# EAGLE design small_Eagle (1) (EAGLE 9.5.2)
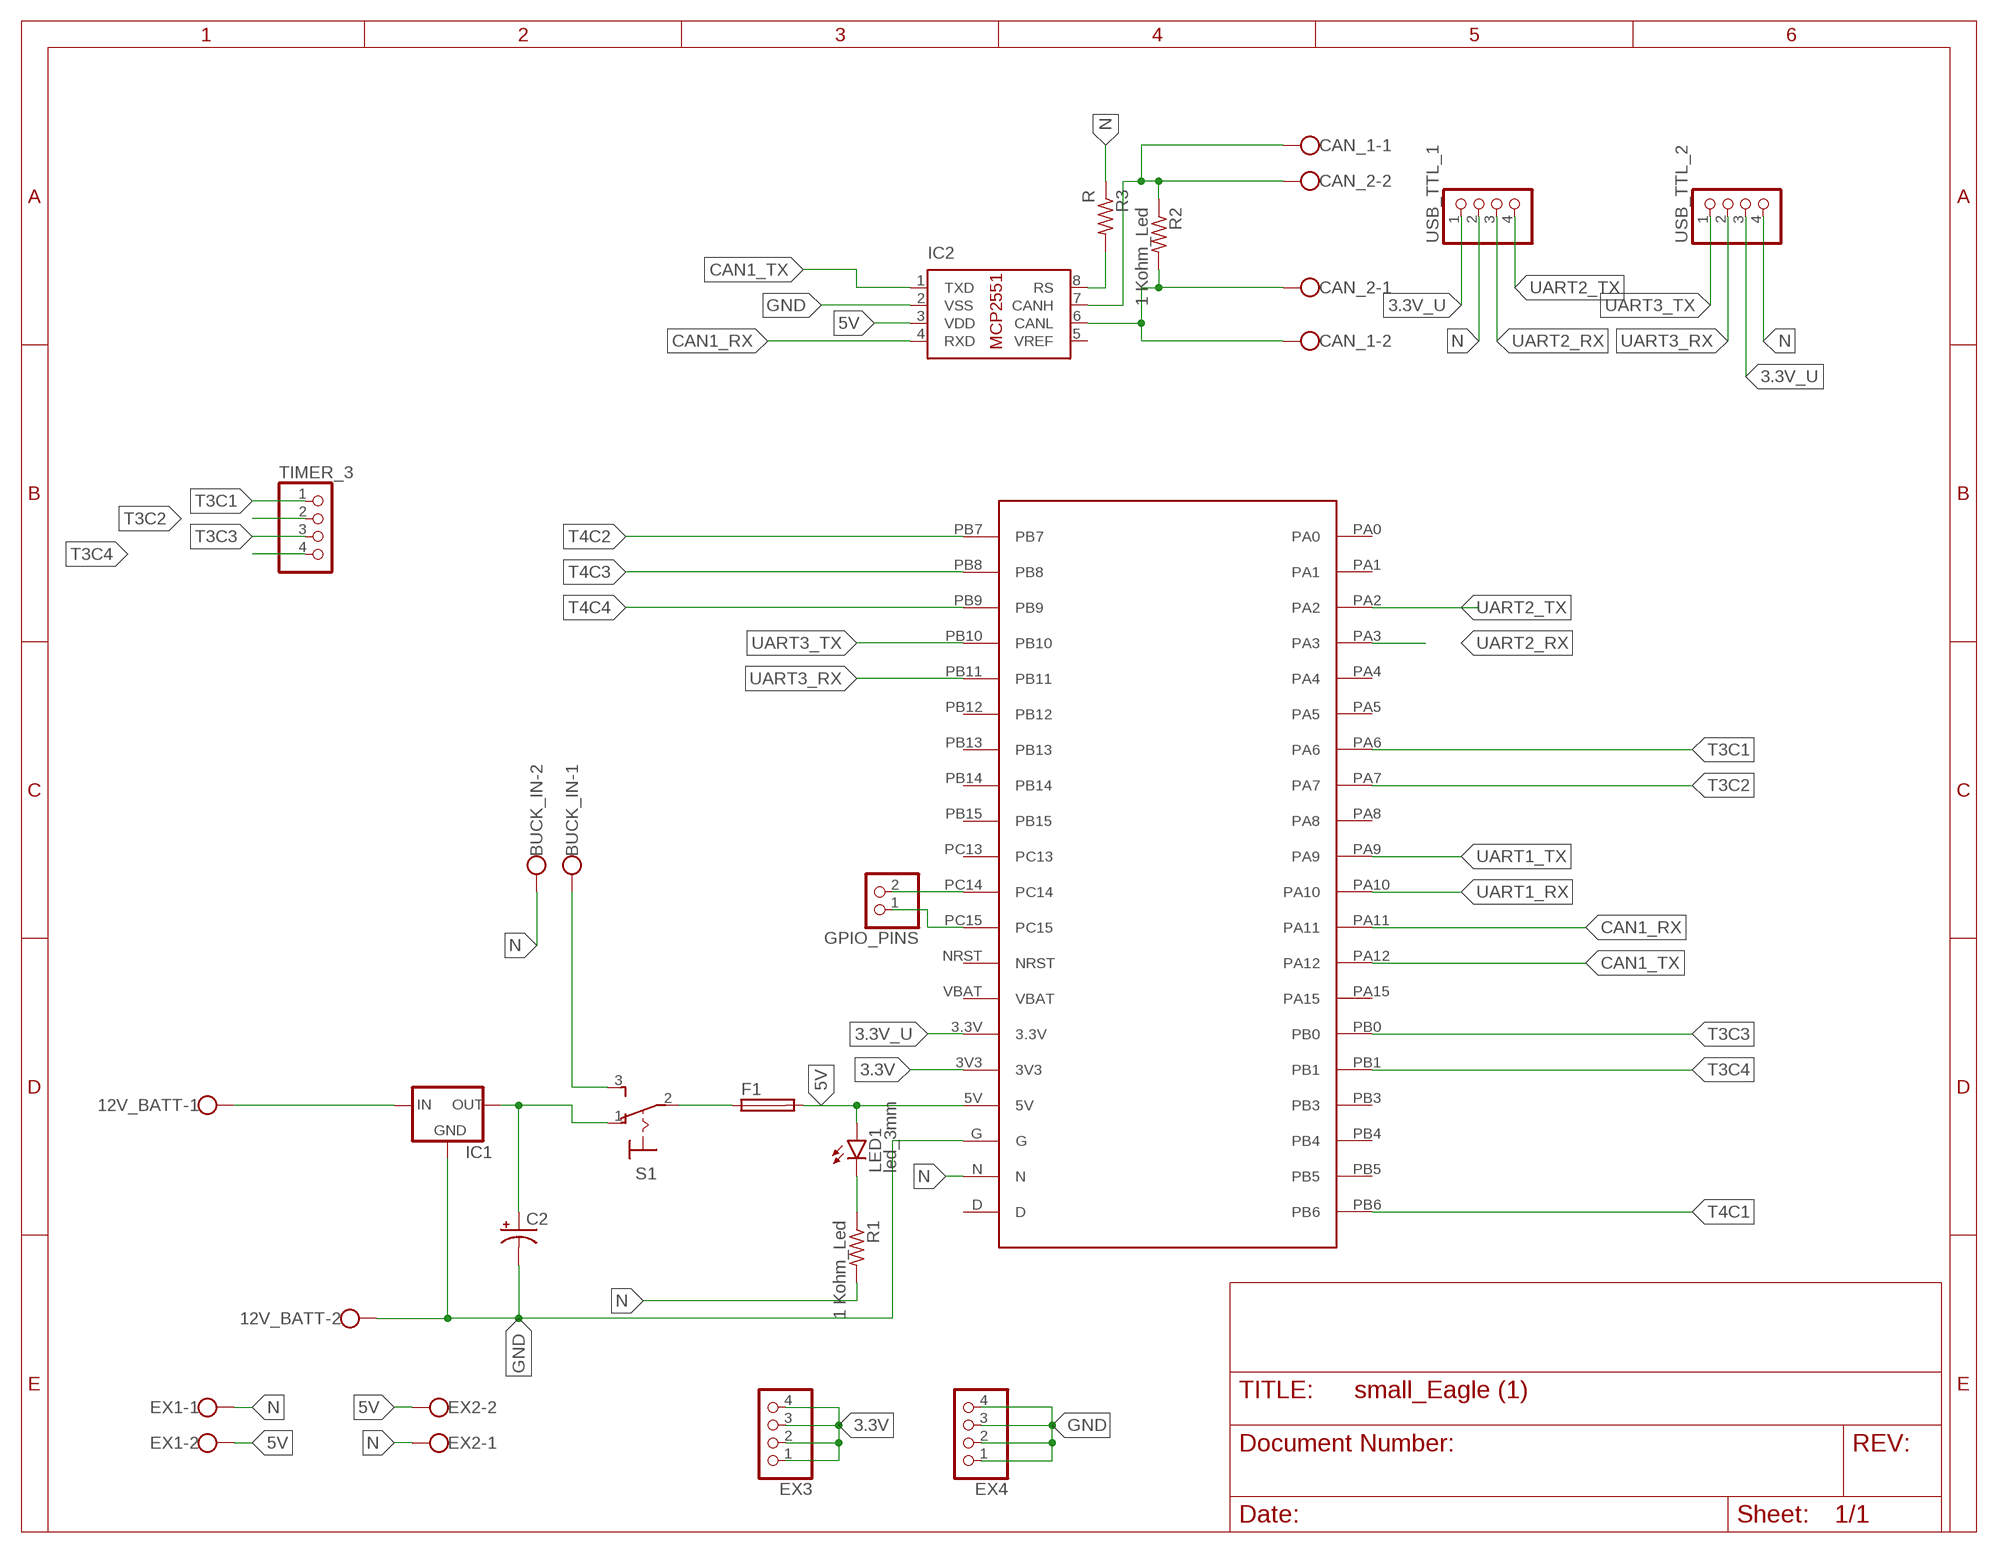
[diagram p0: schematic, sheet 1]

## Parts
12V_BATT  W237-102  [W237-102]
BUCK_IN  W237-102  [W237-102]
C2  CPOL-USE2-4  [E2-4]
CAN_1  W237-102  [W237-102]
CAN_2  W237-102  [W237-102]
EX1  W237-102  [W237-102]
EX2  W237-102  [W237-102]
EX3  PINHD-1X4  [1X04]
EX4  PINHD-1X4  [1X04]
F1  GSH15  [GSH15]
GPIO_PINS  PINHD-1X2  [1X02]
IC1  78XXS  [78XXS]
IC2  MCP2551/P  [DIL08]
LED1  led_3mm  LED3MM  [LED3MM]
R1  1 Kohm_Led  R-US_0207/7  [0207/7]
R2  1 Kohm_Led  R-US_0207/7  [0207/7]
R3  R  R-US_0207/7  [0207/7]
S1  320-916  [320-916]
TIMER_3  PINHD-1X4  [1X04]
U$1  STM32F103C8  [DIP]
USB_TTL_1  PINHD-1X4  [1X04]
USB_TTL_2  PINHD-1X4  [1X04]

## Nets
3.3V: EX3.1 EX3.2 EX3.3 EX3.4 U$1.3V3
3.3V_U: U$1.3.3V USB_TTL_1.1 USB_TTL_2.3
5V: EX1.2 EX2.2 F1.2 IC2.3(VDD) LED1.A U$1.5V
CAN1_RX: IC2.4(RXD) U$1.PA11
CAN1_TX: IC2.1(TXD) U$1.PA12
GND: 12V_BATT.2 C2.- EX4.1 EX4.2 EX4.3 EX4.4 IC1.GND IC2.2(VSS) U$1.G
GPIO_PINS: GPIO_PINS.1 U$1.PC15
N: BUCK_IN.2 EX1.1 EX2.1 R1.2 R3.1 U$1.N USB_TTL_1.2 USB_TTL_2.4
N$1: BUCK_IN.1 S1.3(S)
N$2: CAN_1.2 CAN_2.1 IC2.6(CANL) R2.2
N$3: LED1.K(C) R1.1
N$4: F1.1 S1.2(P)
N$5: 12V_BATT.1 IC1.IN
N$6: C2.+ IC1.OUT S1.1(O)
N$7: IC2.8(RS) R3.2
N$8: GPIO_PINS.2 U$1.PC14
N$9: CAN_1.1 CAN_2.2 IC2.7(CANH) R2.1
T3C1: TIMER_3.1 U$1.PA6
T3C2: TIMER_3.2 U$1.PA7
T3C3: TIMER_3.3 U$1.PB0
T3C4: TIMER_3.4 U$1.PB1
T4C1: U$1.PB6
T4C2: U$1.PB7
T4C3: U$1.PB8
T4C4: U$1.PB9
UART1_RX: U$1.PA10
UART1_TX: U$1.PA9
UART2_RX: U$1.PA3 USB_TTL_1.3
UART2_TX: U$1.PA2 USB_TTL_1.4
UART3_RX: U$1.PB11 USB_TTL_2.2
UART3_TX: U$1.PB10 USB_TTL_2.1
Unconnected: IC2.5(VREF) U$1.D U$1.NRST U$1.PA0 U$1.PA1 U$1.PA4 U$1.PA5 U$1.PA8 U$1.PA15 U$1.PB3 U$1.PB4 U$1.PB5 U$1.PB12 U$1.PB13 U$1.PB14 U$1.PB15 U$1.PC13 U$1.VBAT

## Library data of the parts
12V_BATT BUCK_IN CAN_1 CAN_2 EX1 EX2 = con-wago-500:W237-102: WAGO SCREW CLAMP; MPN: 237-102; OC_FARNELL: unknown; OC_NEWARK: 70K9898
C2 = rcl:CPOL-US: POLARIZED CAPACITOR, American symbol; SPICEPREFIX: C
EX3 EX4 TIMER_3 USB_TTL_1 USB_TTL_2 = pinhead:PINHD-1X4: PIN HEADER
F1 = fuse:GSH15: FUSE HOLDER grid 15mm, 19649 Wickmann; MPN: 64900001039; OC_FARNELL: 1271673; OC_NEWARK: 02P0318
GPIO_PINS = pinhead:PINHD-1X2: PIN HEADER
IC1 = v-reg:78XXS: VOLTAGE REGULATOR
IC2 = microchip-dspic:MCP2551: High-Speed CAN Transceiver
LED1 = led:LED: LED OSRAM: - CHIPLED LG R971, LG N971, LY N971, LG Q971, LY Q971, LO R971, LY R971 LH N974, LH R974 LS Q976, LO Q976, LY Q976 LO Q996 - Hyper CHIPLED LW Q18S LB Q993, LB Q99A, LB R99A - SideLED LS A670, LO A670, LY A670, LG A670, LP A670 LB A673, LV A673, LT A673, LW A673 LH A674 LY A675 LS A676, LA A676, LO A676, LY A676, LW A676 LS A679, LY A679, LG A679 - Hyper Micro SIDELED® LS Y876, LA Y876, LO Y876, LY Y876 LT Y87S - SmartLED LW L88C, LW L88S LB L89C, LB L89S, LG L890 LS L89K, LO L89K, LY L89K LS L896, LA L896, LO L896, LY L896 - TOPLED LS T670, LO T670, LY T670, LG T670, LP T670 LSG T670, LSP T670, LSY T670, LOP T670, LYG T670 LG T671, LOG T671, LSG T671 LB T673, LV T673, LT T673, LW T673 LH T674 LS T676, LA T676, LO T676, LY T676, LB T676, LH T676, LSB T676, LW T676 LB T67C, LV T67C, LT T67C, LS T67K, LO T67K, LY T67K, LW E67C LS E67B, LA E67B, LO E67B, LY E67B, LB E67C, LV E67C, LT E67C LW T67C LS T679, LY T679, LG T679 LS T770, LO T770, LY T770, LG T770, LP T770 LB T773, LV T773, LT T773, LW T773 LH T774 LS E675, LA E675, LY E675, LS T675 LS T776, LA T776, LO T776, LY T776, LB T776 LHGB T686 LT T68C, LB T68C - Hyper Mini TOPLED® LB M676 - Mini TOPLED Santana® LG M470 LS M47K, LO M47K, LY M47K Source: http://www.osram.convergy.de LUXEON: - LUMILED® LXK2-PW12-R00, LXK2-PW12-S00, LXK2-PW14-U00, LXK2-PW14-V00 LXK2-PM12-R00, LXK2-PM12-S00, LXK2-PM14-U00 LXK2-PE12-Q00, LXK2-PE12-R00, LXK2-PE12-S00, LXK2-PE14-T00, LXK2-PE14-U00 LXK2-PB12-K00, LXK2-PB12-L00, LXK2-PB12-M00, LXK2-PB14-N00, LXK2-PB14-P00, LXK2-PB14-Q00 LXK2-PR12-L00, LXK2-PR12-M00, LXK2-PR14-Q00, LXK2-PR14-R00 LXK2-PD12-Q00, LXK2-PD12-R00, LXK2-PD12-S00 LXK2-PH12-R00, LXK2-PH12-S00 LXK2-PL12-P00, LXK2-PL12-Q00, LXK2-PL12-R00 Source: www.luxeon.com KINGBRIGHT: KA-3528ASYC Source: www.kingbright.com
R1-R3 = rcl:R-US_: RESISTOR, American symbol; SPICEPREFIX: R
S1 = switch:320-916: TOGGLE SWITCH distributor RS Components
U$1 = stm_developer_board:STM32F103C8: STM32F103C8 Block

## Board
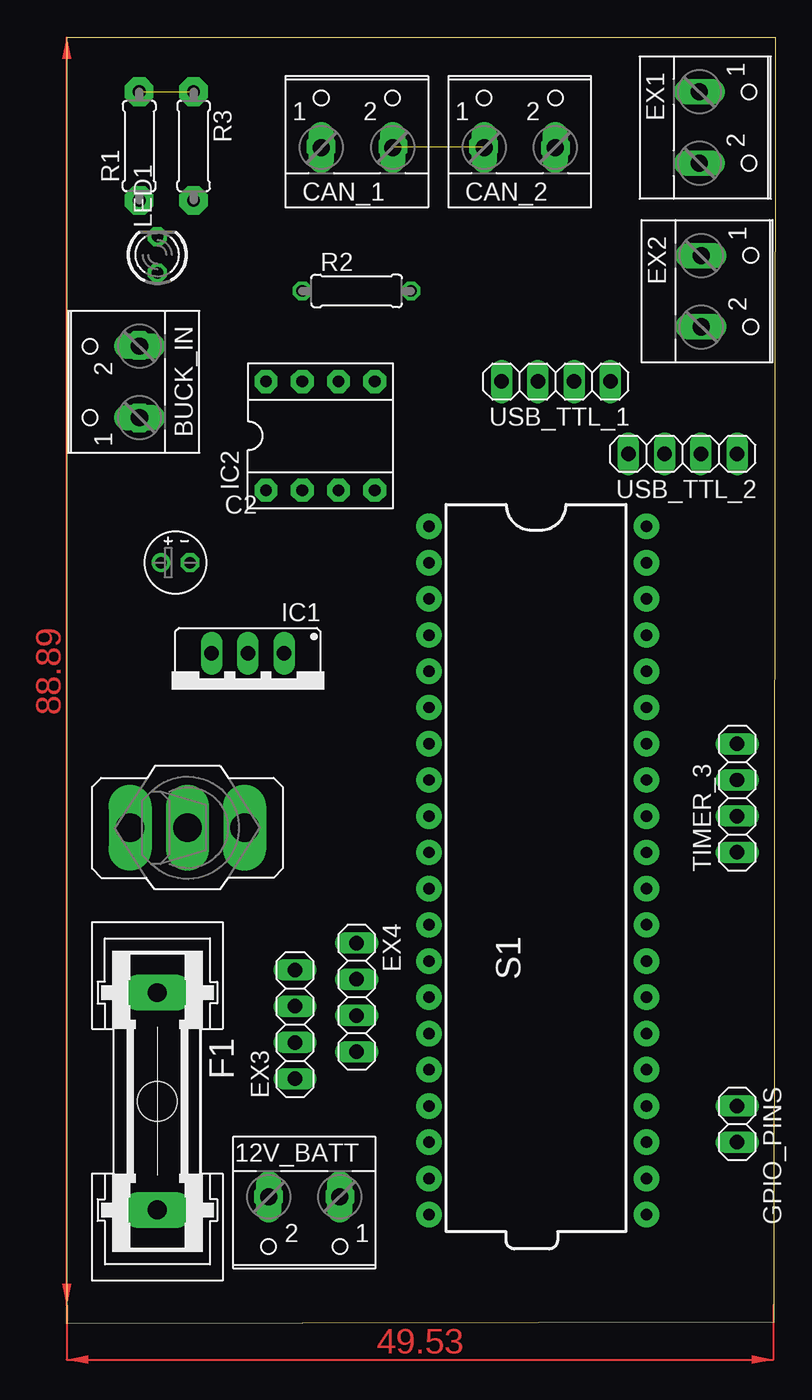
[diagram p1: board, top side]
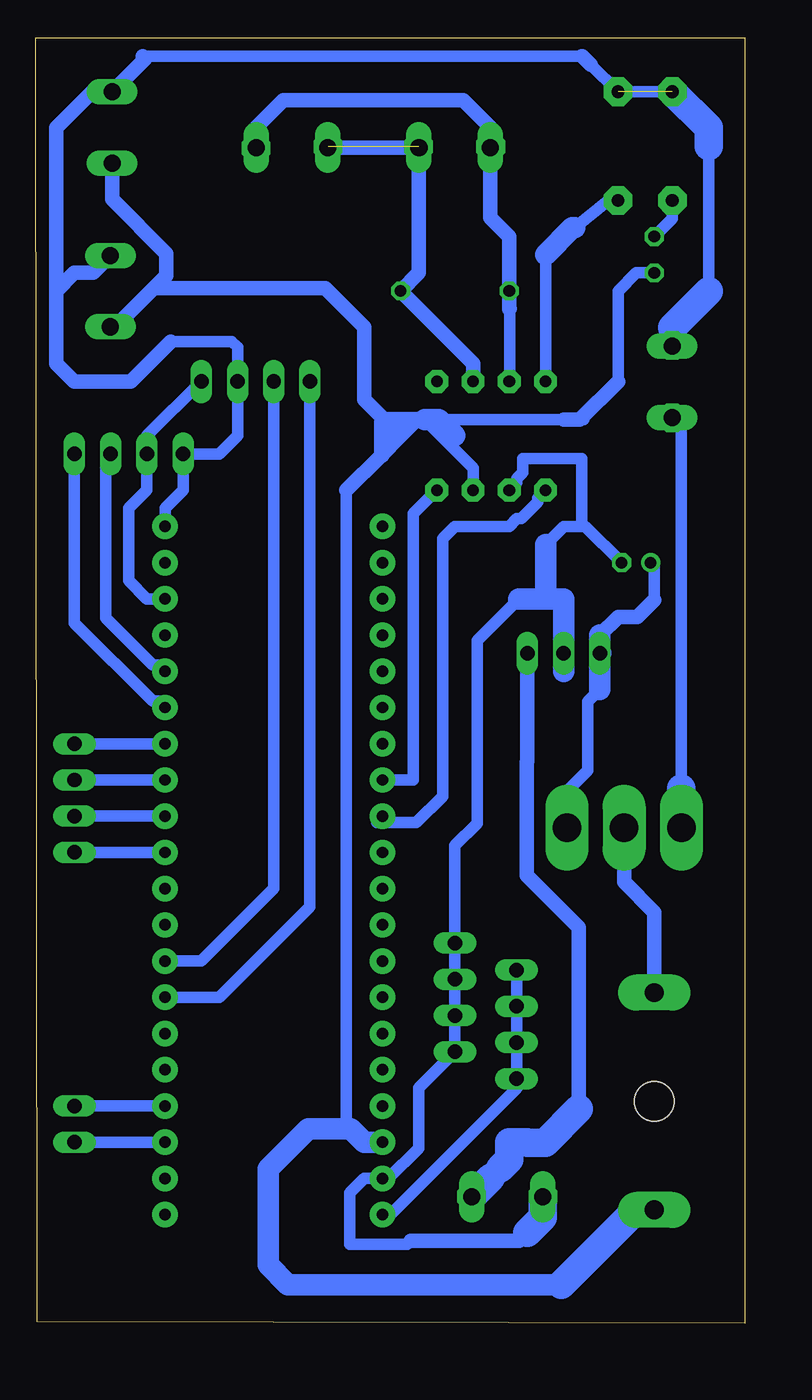
[diagram p2: board, bottom side, seen from below]

Size 49.71 x 90.16 mm. Coordinates in mm from the lower left corner, seen from the top.
Outline: 0,0 49.58,0.13 49.71,90.16 0,90.16 0,0
Copper layers (1*16): Top 0.035mm / dielectric 1.5mm / Bottom 0mil
Design rules "default *": minimum track width 0.8mm, minimum drill 0.8mm, track to track 0.8mm, track to pad 0.8mm, pad to pad 6mil, via to via 6mil, smd to smd 6mil, copper to edge 0.8mm, drill to drill 0.8mm, minimum pad ring 10mil, minimum via ring 8mil, stop-mask expansion 4mil, vias tented up to drill 0mil, thermal gap 10mil

### Footprints (pad centres in the part's own frame; a part is rotated, then mirrored left to right if it is on the bottom)
W237-102 = drill 1.194 long: 1 -2.5,-1.27; 2 2.5,-1.27
E2-4 = drill 0.813 pad 1.27: + -1.016,0 | drill 0.813 pad 1.27 octagon: - 1.016,0
1X04 = drill 1.016 long: 1 -3.81,0; 2 -1.27,0; 3 1.27,0; 4 3.81,0
GSH15 = drill 1.321 pad 2.54 long: 1 -7.62,0; 2 7.62,0 | hole 2.794: 0,0
1X02 = drill 1.016 long: 1 -1.27,0; 2 1.27,0
78XXS = drill 1.016 long: GND 0,-2.54; IN -2.54,-2.54; OUT 2.54,-2.54
DIL08 = drill 0.813 pad 1.6 octagon: 1 -3.81,-3.81; 2 -1.27,-3.81; 3 1.27,-3.81; 4 3.81,-3.81; 5 3.81,3.81; 6 1.27,3.81; 7 -1.27,3.81; 8 -3.81,3.81
LED3MM = drill 0.813 octagon: A -1.27,0; K 1.27,0
0207/7 = drill 0.813 octagon: 1 -3.81,0; 2 3.81,0
320-916 = drill 2.007 long: 1 0,4.013; 2 0,0; 3 0,-4.013
DIP = drill 0.8 pad 1.778: 3.3V 15.24,43.18; 3V3 0,0; 5V 0,5.08; D 15.24,45.72; G 0,2.54; N 15.24,48.26; NRST 15.24,40.64; PA0 15.24,10.16; PA1 15.24,12.7; PA2 15.24,15.24; PA3 15.24,17.78; PA4 15.24,20.32; PA5 15.24,22.86; PA6 15.24,25.4; PA7 15.24,27.94; PA8 0,38.1; PA9 0,35.56; PA10 0,33.02; PA11 0,30.48; PA12 0,27.94; PA15 0,25.4; PB0 15.24,30.48; PB1 15.24,33.02; PB3 0,22.86; PB4 0,20.32; PB5 0,17.78; PB6 0,15.24; PB7 0,12.7; PB8 0,10.16; PB9 0,7.62; PB10 15.24,35.56; PB11 15.24,38.1; PB12 0,48.26; PB13 0,45.72; PB14 0,43.18; PB15 0,40.64; PC13 15.24,2.54; PC14 15.24,5.08; PC15 15.24,7.62; VBAT 15.24,0

### Placement (x,y rotation side)
12V_BATT  16.65,7.6 180 top
BUCK_IN  3.83,66.01 90 top
C2  7.62,53.34 0 top
CAN_1  20.34,83.72 0 top
CAN_2  31.75,83.72 0 top
EX1  45.62,83.85 270 top
EX2  45.74,72.37 270 top
EX3  16,20.95 90 top
EX4  20.32,22.86 270 top
F1  6.35,15.57 270 top
GPIO_PINS  46.99,13.97 270 top
IC1  12.7,44.45 180 top
IC2  17.78,62.23 0 top
LED1  6.35,74.93 90 top
R1  5.08,82.55 90 top
R2  20.32,72.39 0 top
R3  8.89,82.55 270 top
S1  8.46,34.75 270 top
TIMER_3  46.99,36.83 90 top
U$1  25.4,7.62 0 top
USB_TTL_1  34.29,66.04 180 top
USB_TTL_2  43.18,60.96 180 top

### Tracks (layer width: path | path; a pad name or v marks a point on that pad's centre or on a via)
3.3V
  Bottom 0.8: U$1.3V3 24.84,7.62 16,16.46 EX3.1 EX3.2 EX3.3 EX3.4
3.3V_U
  Bottom 0.8: U$1.3.3V 41.91,50.8 43.18,52.07 43.18,57.15 41.91,58.42 USB_TTL_2.3 41.91,62.23 USB_TTL_1.1
5V
  Bottom 0.8: 22.61,63.37 22.45,63.37 19.05,59.98 IC2.3 | U$1.5V 26.4,12.7 27.35,13.65 27.94,13.65 | 27.94,13.65 30.61,13.65 | 27.94,13.65 27.94,58.42 | 8.89,66.04 8.89,72.39 7.62,73.66 LED1.A | 11.3,63.37 12.7,63.37 21.59,63.37
  Bottom 1: 8.89,66.04 11.56,63.37 12.7,63.37 | EX1.2 44.35,78.81 40.55,75.02 40.55,73.45 41.43,72.57 | EX2.2 44.13,69.87 41.43,72.57 | 41.43,72.57 29.39,72.57 26.67,69.85 26.67,64.77 25.3,63.4 | 27.94,58.42 25.5,60.86 | 25.4,60.86 25.5,60.86 | 24.13,63.4 22.47,63.4 22.45,63.37 22.99,63.37 24.13,62.23 | 24.13,63.4 25.3,63.4 | 24.13,62.23 25.5,60.86 | 25.5,60.86 25.5,62.23 | 25.5,62.23 25.5,63.2 25.3,63.4 | 25.3,62.23 24.13,62.23 | 25.5,62.23 25.3,62.23 | 25.3,62.23 24.13,63.4
  Bottom 1.5: U$1.5V 26.67,12.7 27.62,13.65 30.61,13.65 33.42,10.84 33.42,4.09 32.04,2.72 12.85,2.72 | 21.59,63.37 20.45,62.23 20.32,62.23 21.46,63.37 22.45,63.37
  Bottom 2: F1.2 7.62,7.95 12.85,2.72
CAN1_RX
  Bottom 0.8: IC2.4 23.23,56.78 23.23,38.1 U$1.PA11
CAN1_TX
  Bottom 0.8: 24.95,35.11 25.8,35.11 | 24.95,35.11 23.02,35.11 21.18,36.95 21.18,55.02 20.32,55.88 16.51,55.88 15.97,56.42 15.68,56.42 14.51,57.59 14.51,57.88 IC2.1 | U$1.PA12 24.95,35.11
GND
  Bottom 0.8: 23.43,5.78 23.66,5.55 27.69,5.55 27.69,9.14 26.67,10.16 U$1.G 24.98,10.16 22.86,12.28 22.86,16.51 EX4.4 EX4.3 EX4.2 EX4.1 20.32,33.51 18.77,35.06 18.77,47.88 15.85,50.8 13.97,50.8 12.7,50.8 | IC2.2 15.97,58.96 15.97,59.25 15.57,59.65 15.57,60.63 11.43,60.63 11.43,55.88 | 13.97,54.61 12.7,55.88 11.43,55.88 | 11.43,55.88 11.18,55.88 C2.-
  Bottom 1: 23.43,5.78 15.81,5.78 15.24,6.35
  Bottom 1.5: 12.7,45.72 IC1.GND 12.7,50.8 15.85,50.8 | 13.97,50.8 13.97,54.61
  Bottom 2: 12V_BATT.2 14.15,7.44 15.24,6.35
GPIO_PINS
  Bottom 0.8: U$1.PC15 GPIO_PINS.1
N
  Bottom 0.8: U$1.N 40.64,57.15 39.37,58.42 USB_TTL_2.4 36.83,60.96 35.56,62.23 USB_TTL_1.2 35.56,68.43 35.97,68.84 40.23,68.84 | 2.54,72.36 2.54,82.55 | R1.2 R3.1 10.79,88.27 | 11.43,88.85 42.2,88.85 | BUCK_IN.2 5.08,68.53 5.08,69.83
  Bottom 1: 42.2,88.85 42.02,88.67 EX1.1 45.73,86.35 48.26,83.82 48.26,72.39 | 48.26,72.39 48.26,67.31 46.99,66.04 43.03,66.04 40.23,68.84 | 48.26,72.39 46.99,73.66 45.68,73.66 EX2.1 | 10.79,88.27 11.38,88.85 11.43,88.85
  Bottom 2: 5.08,69.83 2.54,72.36 | R1.2 2.54,83.82 2.54,82.55
N$1
  Bottom 0.8: S1.3 4.45,62.86 BUCK_IN.1
  Bottom 2: S1.3 4.45,37.49
N$2
  Bottom 0.8: R2.2 24.11,72.42
  Bottom 1: CAN_2.1 CAN_1.2 22.84,73.68 R2.2 19.05,67.31 IC2.6
N$3
  Bottom 0.8: R1.1 5.08,77.47 LED1.K
N$4
  Bottom 1: S1.2 8.46,30.94 6.35,28.83 F1.1
N$5
  Bottom 1: IC1.IN 15.24,39.4 15.28,39.36 15.28,31.41 11.63,27.76 11.63,15.04 | 17.82,10.2 17.16,10.86 | 15.24,12.7 14.03,12.7 14,12.67
  Bottom 2: 12V_BATT.1 17.82,10.2 | 17.16,10.86 16.51,11.51 16.51,12.7 15.24,12.7 15.21,12.67 14,12.67 11.63,15.04
N$6
  Bottom 0.8: 6.35,50.73 6.35,53.09 C2.+ | S1.1 12.47,37.29 11,38.76 11,43.61 10.16,44.45
  Bottom 1: 6.35,50.73 7.55,49.53 8.89,49.53 10.16,48.26
  Bottom 1.5: 10.16,48.26 IC1.OUT | IC1.OUT 10.09,46.99 | IC1.OUT 10.16,44.45
N$7
  Bottom 0.8: 13.97,66.67 IC2.8 13.97,74.93 | R3.2 9.53,78.74 11.93,76.82
  Bottom 1.5: 13.97,74.93 12.08,76.82 11.93,76.82
N$8
  Bottom 0.8: U$1.PC14 GPIO_PINS.2
N$9
  Bottom 0.8: 16.46,71.17 16.46,66.08 IC2.7
  Bottom 1: CAN_2.2 34.25,83.86 32.35,85.76 19.72,85.76 17.84,83.88 CAN_1.1 17.84,77.53 16.51,76.2 R2.1 16.51,71.12 16.46,71.17
N$10  (via drill 0.9 pad 2)  (1 unrouted)
  other vias: 22.86,82.5 29.21,82.5
N$11  (via drill 0.9 pad 2)
  other vias: 14.15,8.89
N$12  (via drill 0.9 pad 2)
  other vias: 6.36,7.96
N$13  (via drill 0.9 pad 2)
  other vias: 6.36,23.25
N$14  (via drill 0.9 pad 2)
  other vias: 12.45,34.72
N$15  (via drill 0.9 pad 2)
  other vias: 8.89,78.74
N$18  (via drill 0.9 pad 2)
  other vias: 34.26,82.4
N$19  (via drill 0.9 pad 2)
  other vias: 17.81,82.5
N$22  (via drill 0.9 pad 2)  (1 unrouted)
  other vias: 8.89,86.36 5.08,86.36
N$23  (via drill 0.9 pad 2)
  other vias: 19.15,8.89
N$25  (via drill 0.9 pad 2)
  other vias: 4.45,34.77
N$26  (via drill 0.9 pad 2)
  other vias: 8.45,34.77
N$27  (via drill 0.9 pad 2)
  other vias: 5.08,63.5
N$28  (via drill 0.9 pad 2)
  other vias: 5.08,68.58
N$29  (via drill 0.9 pad 2)
  other vias: 5.08,78.74
T3C1
  Bottom 0.8: U$1.PA6 TIMER_3.1
T3C2
  Bottom 0.8: U$1.PA7 TIMER_3.2
T3C3
  Bottom 0.8: U$1.PB0 TIMER_3.3
T3C4
  Bottom 0.8: U$1.PB1 TIMER_3.4
UART2_RX
  Bottom 0.8: U$1.PA3 38.1,25.4 33.02,30.48 USB_TTL_1.3
UART2_TX
  Bottom 0.8: U$1.PA2 36.83,22.86 30.48,29.21 USB_TTL_1.4
UART3_RX
  Bottom 0.8: U$1.PB11 41.09,46.17 41.51,46.17 44.78,49.45 44.78,60.63 USB_TTL_2.2
UART3_TX
  Bottom 0.8: U$1.PB10 41.09,43.63 41.51,43.63 46.99,49.12 USB_TTL_2.1
(copper drawn outside any net)
  shapes: Top area x2